# Altium schematic sheet 12_LMS2_Power.SchDoc: LMS7002M power supply (LMS2)
size A3; Organization: Lime Microsystems; Address1: Surrey Tech Centre; Address2: Guildford GU2 7YG; Address3: Surrey; Address4: United Kingdom; Revision: v1.0; SheetNumber: 10; SheetTotal: 31
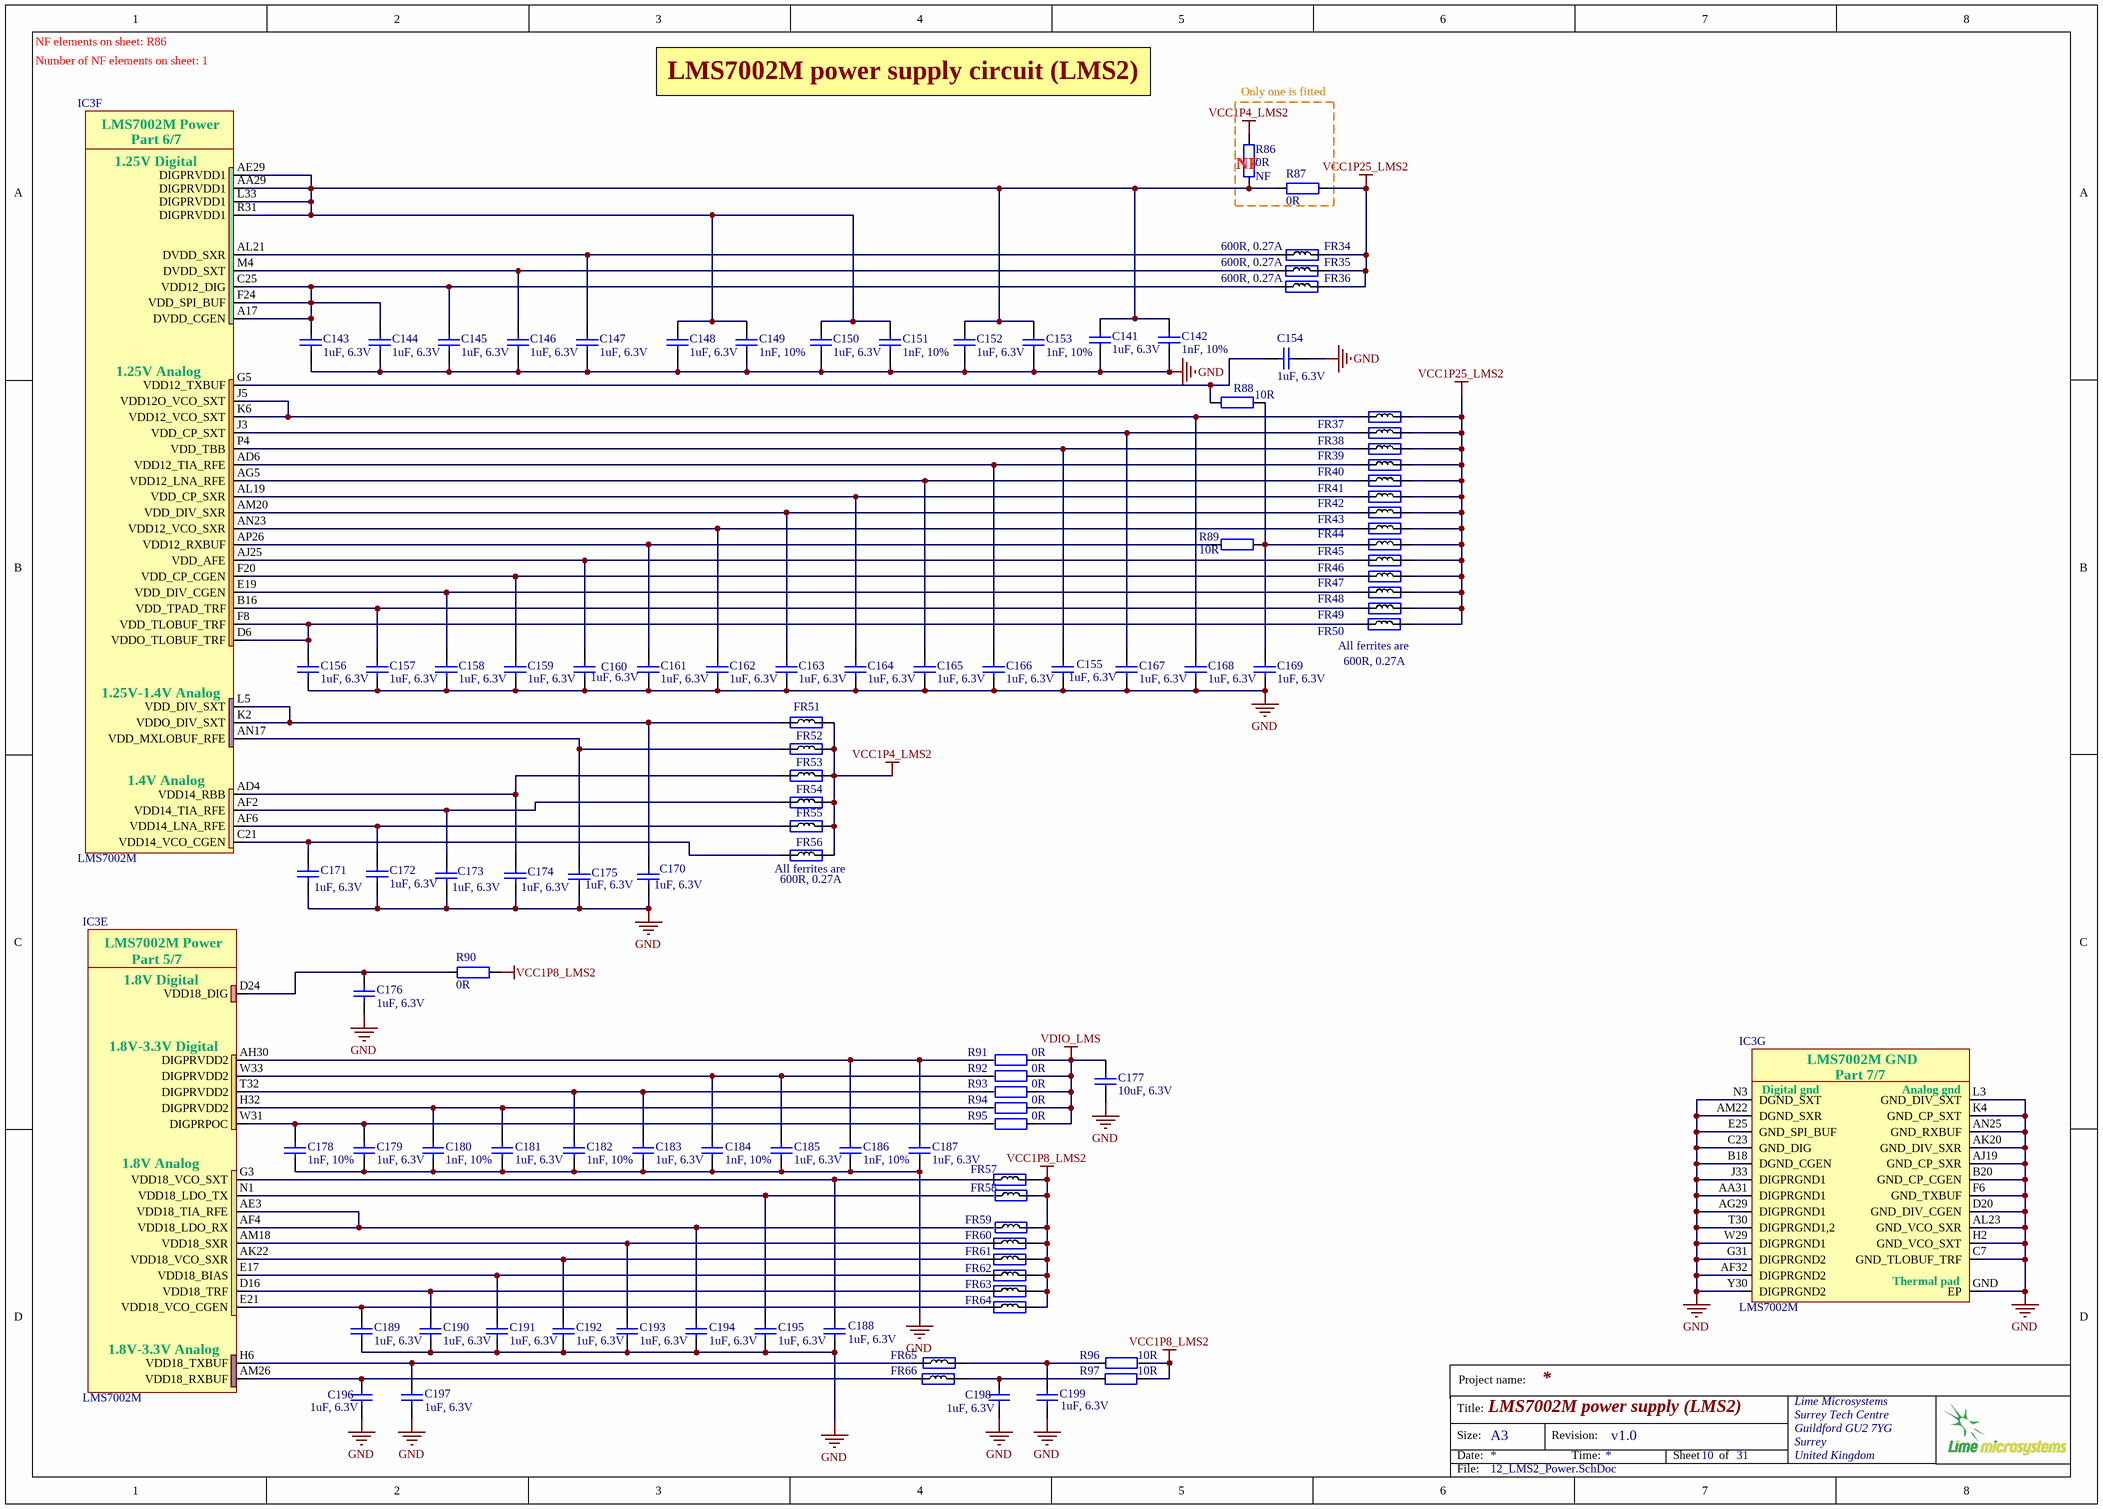
[diagram p0: 12_LMS2_Power.SchDoc]

## Parts
C141  1uF, 6.3V  [CAP0201]
C142  1nF, 10%  [CAP0201]
C143  1uF, 6.3V  [CAP0201]
C144  1uF, 6.3V  [CAP0201]
C145  1uF, 6.3V  [CAP0201]
C146  1uF, 6.3V  [CAP0201]
C147  1uF, 6.3V  [CAP0201]
C148  1uF, 6.3V  [CAP0201]
C149  1nF, 10%  [CAP0201]
C150  1uF, 6.3V  [CAP0201]
C151  1nF, 10%  [CAP0201]
C152  1uF, 6.3V  [CAP0201]
C153  1nF, 10%  [CAP0201]
C154  1uF, 6.3V  [CAP0201]
C155  1uF, 6.3V  [CAP0201]
C156  1uF, 6.3V  [CAP0201]
C157  1uF, 6.3V  [CAP0201]
C158  1uF, 6.3V  [CAP0201]
C159  1uF, 6.3V  [CAP0201]
C160  1uF, 6.3V  [CAP0201]
C161  1uF, 6.3V  [CAP0201]
C162  1uF, 6.3V  [CAP0201]
C163  1uF, 6.3V  [CAP0201]
C164  1uF, 6.3V  [CAP0201]
C165  1uF, 6.3V  [CAP0201]
C166  1uF, 6.3V  [CAP0201]
C167  1uF, 6.3V  [CAP0201]
C168  1uF, 6.3V  [CAP0201]
C169  1uF, 6.3V  [CAP0201]
C170  1uF, 6.3V  [CAP0201]
C171  1uF, 6.3V  [CAP0201]
C172  1uF, 6.3V  [CAP0201]
C173  1uF, 6.3V  [CAP0201]
C174  1uF, 6.3V  [CAP0201]
C175  1uF, 6.3V  [CAP0201]
C176  1uF, 6.3V  [CAP0201]
C177  10uF, 6.3V  [CAP0603]
C178  1nF, 10%  [CAP0201]
C179  1uF, 6.3V  [CAP0201]
C180  1nF, 10%  [CAP0201]
C181  1uF, 6.3V  [CAP0201]
C182  1nF, 10%  [CAP0201]
C183  1uF, 6.3V  [CAP0201]
C184  1nF, 10%  [CAP0201]
C185  1uF, 6.3V  [CAP0201]
C186  1nF, 10%  [CAP0201]
C187  1uF, 6.3V  [CAP0201]
C188  1uF, 6.3V  [CAP0201]
C189  1uF, 6.3V  [CAP0201]
C190  1uF, 6.3V  [CAP0201]
C191  1uF, 6.3V  [CAP0201]
C192  1uF, 6.3V  [CAP0201]
C193  1uF, 6.3V  [CAP0201]
C194  1uF, 6.3V  [CAP0201]
C195  1uF, 6.3V  [CAP0201]
C196  1uF, 6.3V  [CAP0201]
C197  1uF, 6.3V  [CAP0201]
C198  1uF, 6.3V  [CAP0201]
C199  1uF, 6.3V  [CAP0201]
FR34  600R, 0.27A  [RES0201]
FR35  600R, 0.27A  [RES0201]
FR36  600R, 0.27A  [RES0201]
FR37  600R, 0.27A  [RES0201]  (value not drawn)
FR38  600R, 0.27A  [RES0201]  (value not drawn)
FR39  600R, 0.27A  [RES0201]  (value not drawn)
FR40  600R, 0.27A  [RES0201]  (value not drawn)
FR41  600R, 0.27A  [RES0201]  (value not drawn)
FR42  600R, 0.27A  [RES0201]  (value not drawn)
FR43  600R, 0.27A  [RES0201]  (value not drawn)
FR44  600R, 0.27A  [RES0201]  (value not drawn)
FR45  600R, 0.27A  [RES0201]  (value not drawn)
FR46  600R, 0.27A  [RES0201]  (value not drawn)
FR47  600R, 0.27A  [RES0201]  (value not drawn)
FR48  600R, 0.27A  [RES0201]  (value not drawn)
FR49  600R, 0.27A  [RES0201]  (value not drawn)
FR50  600R, 0.27A  [RES0201]  (value not drawn)
FR51  600R, 0.27A  [RES0201]  (value not drawn)
FR52  600R, 0.27A  [RES0201]  (value not drawn)
FR53  600R, 0.27A  [RES0201]  (value not drawn)
FR54  600R, 0.27A  [RES0201]  (value not drawn)
FR55  600R, 0.27A  [RES0201]  (value not drawn)
FR56  600R, 0.27A  [RES0201]  (value not drawn)
FR57  600R, 0.27A  [RES0201]  (value not drawn)
FR58  600R, 0.27A  [RES0201]  (value not drawn)
FR59  600R, 0.27A  [RES0201]  (value not drawn)
FR60  600R, 0.27A  [RES0201]  (value not drawn)
FR61  600R, 0.27A  [RES0201]  (value not drawn)
FR62  600R, 0.27A  [RES0201]  (value not drawn)
FR63  600R, 0.27A  [RES0201]  (value not drawn)
FR64  600R, 0.27A  [RES0201]  (value not drawn)
FR65  600R, 0.27A  [RES0201]  (value not drawn)
FR66  600R, 0.27A  [RES0201]  (value not drawn)
IC3  LMS7002M  [LMS7002M_v5]  (parts E,F,G of 7)
R86  0R  Assembly Info: NF  [RES0402]
R87  0R  [RES0402]
R88  10R  [RES0201]
R89  10R  [RES0201]
R90  0R  [RES0201]
R91  0R  [RES0402]
R92  0R  [RES0402]
R93  0R  [RES0402]
R94  0R  [RES0402]
R95  0R  [RES0402]
R96  10R  [RES0201]
R97  10R  [RES0201]

## Blocks framed on the sheet
Only one is fitted: R86 R87

## Nets
GND: C141.2 C142.2 C143.2 C144.2 C145.2 C146.1 C147.2 C148.2 C149.2 C150.2 C151.2 C152.2 C153.2 C154.2 C155.2 C156.2 C157.2 C158.2 C159.1 C160.2 C161.2 C162.2 C163.2 C164.2 C165.2 C166.1 C167.2 C168.1 C169.1 C170.2 C171.2 C172.2 C173.2 C174.2 C175.2 C176.2 C177.1 C178.2 C179.2 C180.2 C181.2 C182.2 C183.2 C184.2 C185.2 C186.2 C187.2 C188.2 C189.2 C190.2 C191.2 C192.2 C193.2 C194.2 C195.2 C196.2 C197.2 C198.2 C199.2 IC3.AA31(DIGPRGND1) IC3.AF32(DIGPRGND2) IC3.AG29(DIGPRGND1) IC3.AJ19(GND_CP_SXR) IC3.AK20(GND_DIV_SXR) IC3.AL23(GND_VCO_SXR) IC3.AM22(DGND_SXR) IC3.AN25(GND_RXBUF) IC3.B18(DGND_CGEN) IC3.B20(GND_CP_CGEN) IC3.C7(GND_TLOBUF_TRF) IC3.C23(GND_DIG) IC3.D20(GND_DIV_CGEN) IC3.E25(GND_SPI_BUF) IC3.F6(GND_TXBUF) IC3.G31(DIGPRGND2) IC3.GND(EP) IC3.H2(GND_VCO_SXT) IC3.J33(DIGPRGND1) IC3.K4(GND_CP_SXT) IC3.L3(GND_DIV_SXT) IC3.N3(DGND_SXT) IC3.T30(DIGPRGND1,2) IC3.W29(DIGPRGND1) IC3.Y30(DIGPRGND2)
VCC1P4_LMS2: FR51.2 FR52.2 FR53.2 FR54.2 FR55.2 FR56.2 R86.1
VCC1P8_LMS2: FR57.2 FR58.1 FR59.1 FR60.2 FR61.2 FR62.2 FR63.2 FR64.2 R90.2 R96.2 R97.1
VCC1P25_LMS2: FR34.2 FR35.2 FR36.2 FR37.2 FR38.2 FR39.2 FR40.2 FR41.2 FR42.2 FR43.2 FR44.2 FR45.2 FR46.2 FR47.2 FR48.2 FR49.2 FR50.2 R87.1
VDIO_LMS: C177.2 R91.1 R92.1 R93.1 R94.1 R95.1
NetC141_1: C141.1 C142.1 C148.1 C149.1 C150.1 C151.1 C152.1 C153.1 IC3.AA29(DIGPRVDD1) IC3.AE29(DIGPRVDD1) IC3.L33(DIGPRVDD1) IC3.R31(DIGPRVDD1) R86.2 R87.2
NetC143_1: C143.1 C144.1 C145.1 FR36.1 IC3.A17(DVDD_CGEN) IC3.C25(VDD12_DIG) IC3.F24(VDD_SPI_BUF)
NetC146_2: C146.2 FR35.1 IC3.M4(DVDD_SXT)
NetC147_1: C147.1 FR34.1 IC3.AL21(DVDD_SXR)
NetC154_1: C154.1 IC3.G5(VDD12_TXBUF) R88.1
NetC155_1: C155.1 FR39.1 IC3.P4(VDD_TBB)
NetC156_1: C156.1 FR50.1 IC3.D6(VDDO_TLOBUF_TRF) IC3.F8(VDD_TLOBUF_TRF)
NetC157_1: C157.1 FR49.1 IC3.B16(VDD_TPAD_TRF)
NetC158_1: C158.1 FR48.1 IC3.E19(VDD_DIV_CGEN)
NetC159_2: C159.2 FR47.1 IC3.F20(VDD_CP_CGEN)
NetC160_1: C160.1 FR46.1 IC3.AJ25(VDD_AFE)
NetC161_1: C161.1 IC3.AP26(VDD12_RXBUF) R89.1
NetC162_1: C162.1 FR44.1 IC3.AN23(VDD12_VCO_SXR)
NetC163_1: C163.1 FR43.1 IC3.AM20(VDD_DIV_SXR)
NetC164_1: C164.1 FR42.1 IC3.AL19(VDD_CP_SXR)
NetC165_1: C165.1 FR41.1 IC3.AG5(VDD12_LNA_RFE)
NetC166_2: C166.2 FR40.1 IC3.AD6(VDD12_TIA_RFE)
NetC167_1: C167.1 FR38.1 IC3.J3(VDD_CP_SXT)
NetC168_2: C168.2 FR37.1 IC3.J5(VDD12O_VCO_SXT) IC3.K6(VDD12_VCO_SXT)
NetC169_2: C169.2 FR45.1 R88.2 R89.2
NetC170_1: C170.1 FR51.1 IC3.K2(VDDO_DIV_SXT) IC3.L5(VDD_DIV_SXT)
NetC171_1: C171.1 FR56.1 IC3.C21(VDD14_VCO_CGEN)
NetC172_1: C172.1 FR55.1 IC3.AF6(VDD14_LNA_RFE)
NetC173_1: C173.1 FR54.1 IC3.AF2(VDD14_TIA_RFE)
NetC174_1: C174.1 FR53.1 IC3.AD4(VDD14_RBB)
NetC175_1: C175.1 FR52.1 IC3.AN17(VDD_MXLOBUF_RFE)
NetC176_1: C176.1 IC3.D24(VDD18_DIG) R90.1
NetC178_1: C178.1 C179.1 IC3.W31(DIGPRPOC) R95.2
NetC180_1: C180.1 C181.1 IC3.H32(DIGPRVDD2) R94.2
NetC182_1: C182.1 C183.1 IC3.T32(DIGPRVDD2) R93.2
NetC184_1: C184.1 C185.1 IC3.W33(DIGPRVDD2) R92.2
NetC186_1: C186.1 C187.1 IC3.AH30(DIGPRVDD2) R91.2
NetC188_1: C188.1 FR57.1 IC3.G3(VDD18_VCO_SXT)
NetC189_1: C189.1 FR64.1 IC3.E21(VDD18_VCO_CGEN)
NetC190_1: C190.1 FR63.1 IC3.D16(VDD18_TRF)
NetC191_1: C191.1 FR62.1 IC3.E17(VDD18_BIAS)
NetC192_1: C192.1 FR61.1 IC3.AK22(VDD18_VCO_SXR)
NetC193_1: C193.1 FR60.1 IC3.AM18(VDD18_SXR)
NetC194_1: C194.1 FR59.2 IC3.AE3(VDD18_TIA_RFE) IC3.AF4(VDD18_LDO_RX)
NetC195_1: C195.1 FR58.2 IC3.N1(VDD18_LDO_TX)
NetC196_1: C196.1 FR66.1 IC3.AM26(VDD18_RXBUF)
NetC197_1: C197.1 FR65.2 IC3.H6(VDD18_TXBUF)
NetC198_1: C198.1 FR66.2 R97.2
NetC199_1: C199.1 FR65.1 R96.1

## Notes on the sheet
- NF elements on sheet: R86
- Number of NF elements on sheet: 1
- LMS7002M power supply circuit (LMS2)
- (near R86) NF
- (near FR50) All ferrites are
- 600R, 0.27A
- (near FR56) All ferrites are
- (near FR56) 600R, 0.27A
- Project name:
- Title:
- Size:
- Date:
- A3
- Revision:
- Time:
- Sheet
- of
- File:
- (in symbol LMS7002Mr4, part E) LMS7002M Power; Part 5/7; 1.8V Digital; 1.8V-3.3V Digital; 1.8V Analog; 1.8V-3.3V Analog
- (in symbol LMS7002Mr4, part F) LMS7002M Power; Part 6/7; 1.25V Digital; 1.25V Analog; 1.25V-1.4V Analog; 1.4V Analog
- (in symbol LMS7002Mr4, part G) LMS7002M GND; Part 7/7; Digital gnd; Analog gnd; Thermal pad

## Library data of the parts
C141 C143-C148 C150 C152 C154-C176 C179 C181 C183 C185 C187-C199 = Cap_0402: Manufacturer: TDK Corporation; Manufacturer Part Number 1: JMK063ABJ105MP-F; Part Description: 1µF ±20% 6.3V X5R Ceramic Capacitor -55°C ~ 85°C Surface Mount, MLCC 0201 (0603 Metric) 0.024" L x 0.012" W (0.60mm x 0.30mm); Value: 1uF, 20%; Tolerance: ±20%; Capacitance: 1.0µF; Temperature Coefficient: X5R; Supplier 1: Digi-Key; Supplier Part Number 1: 587-5864-2-ND; Applications: General Purpose; Features: -; Lead Style: -; Ratings: -; Thickness (Max): -; Lead Spacing: -; Height - Seated (Max): -; Size / Dimension: 0.024" L x 0.012" W (0.60mm x 0.30mm); Mounting Type: Surface Mount, MLCC; Operating Temperature: -55°C ~ 85°C; Package / Case: 0201 (0603 Metric); Packaging: Cut Tape (CT); Voltage - Rated: 6.3V; Category: Capacitors; RoHS: RoHS Compliant
C142 C149 C151 C153 C178 C180 C182 C184 C186 = Cap_0402: Manufacturer Part Number 1: C0603X7R1E102K030BA; Manufacturer: TDK Corporation; Part Description: 1000pF ±10% 25V X7R Ceramic Capacitor -55°C ~ 125°C Surface Mount, MLCC 0201 (0603 Metric) 0.024" L x 0.012" W (0.60mm x 0.30mm); Voltage - Rated: 25V; Temperature Coefficient: X7R; Capacitance: 1000pF; Value: 1nF, 10%; Supplier 1: Digi-Key; Supplier Part Number 1: 445-7275-1-ND; Features: -; Package / Case: 0201 (0603 Metric); Lead Spacing: -; Mounting Type: Surface Mount, MLCC; Lead Style: -; Height - Seated (Max): -; Operating Temperature: -55°C ~ 125°C; Tolerance: ±10%; Size / Dimension: 0.024" L x 0.012" W (0.60mm x 0.30mm); Applications: General Purpose; Ratings: -; Thickness (Max): 0.013" (0.33mm); RoHS: RoHS Compliant; Packaging: Cut Tape (CT); Category: Capacitors
C177 = Cap_0603: Manufacturer Part Number 1: CC0603MRX5R5BB106; Manufacturer: Yageo; Part Description: 10µF ±20% 6.3V X5R Ceramic Capacitor -55°C ~ 85°C Surface Mount, MLCC 0603 (1608 Metric) 0.063" L x 0.031" W (1.60mm x 0.80mm); Capacitance: 10µF; Tolerance: ±20%; Supplier 1: Digi-Key; Supplier Part Number 1: 311-1448-2-ND; Package / Case: 0603 (1608 Metric); Category: Capacitors; Voltage - Rated: 6.3V; Value: 10uF, 6.3V
FR34-FR66 = Ferrite: Manufacturer Part Number 1: BK0603TS601-T; Manufacturer: Taiyo Yuden; Part Description: FERRITE BEAD 600 OHM 0201 1LN; DC Resistance (DCR): 750 mOhm Max; Filter Type: Differential Mode - Single; Impedance @ Frequency: 600 Ohm @ 100MHz; Current Rating: 270mA; Value: 600R@100MHz; Supplier 1: Digi-Key; Supplier Part Number 1: 587-3277-1-ND; Size / Dimension: 0.024" L x 0.012" W (0.60mm x 0.30mm); Package / Case: 0201 (0603 Metric); Height (Max): 0.013" (0.33mm); Mounting Type: Surface Mount; Packaging: Cut Tape (CT); RoHS: RoHS Compliant; Category: Filters
IC3 = LMS7002Mr4: Schematic symbol revision 4. Default footprint - 0.31mm pad; Manufacturer: Lime Microsystems; Part Description: IC FPRF Transceiver LMS7002M; 261 pin aQFN; Supplier 1: Lime Microsystems; Supplier Part Number 1: LMS7002M; Manufacturer Part Number 1: LMS7002M
R86 R87 R91-R95 = Res_0402: Manufacturer Part Number 1: RC0402JR-070RL; Manufacturer: Yageo; Part Description: RES SMD 0.0OHM JUMPER 1/16W 0402; Resistance (Ohms): 0.0; Tolerance: Jumper; Power (Watts): 0.063W, 1/16W; Value: 0R; Supplier 1: Digi-Key; Supplier Part Number 1: 311-0.0JRTR-ND; Category: Resistors; Temperature Coefficient: -; Features: Moisture Resistant; Supplier Device Package: 0402; Height: 0.016" (0.40mm); Package / Case: 0402 (1005 Metric); Operating Temperature: -55°C ~ 155°C; Size / Dimension: 0.039" L x 0.020" W (1.00mm x 0.50mm); Composition: Thick Film; Packaging: Tape & Reel (TR); Number of Terminations: 2; RoHS: RoHS Compliant
R88 R89 R96 R97 = Res_0402: Manufacturer: Panasonic Electronic Components; Part Description: RES SMD 10 OHM 1% 1/20W 0201; Manufacturer Part Number 1: ERJ-1GEF10R0C; Power (Watts): 0.05W, 1/20W; Resistance (Ohms): 10; Tolerance: ±1%; Temperature Coefficient: ±200ppm/°C; Value: 10R; Supplier 1: Digi-Key; Supplier Part Number 1: P10.0ABCT-ND; Package / Case: 0201 (0603 Metric); Height: 0.010" (0.26mm); Supplier Device Package: 0201; Packaging: Cut Tape (CT); Composition: Thick Film; Category: Resistors; Number of Terminations: 2; Size / Dimension: 0.024" L x 0.012" W (0.60mm x 0.30mm); Operating Temperature: -55°C ~ 125°C; Features: -; RoHS: RoHS Compliant
R90 = Res_0402: Manufacturer Part Number 1: RC0201FR-070RL; Manufacturer: Rohm Semiconductor; Part Description: RES SMD 0.0OHM JUMPER 1/20W 0201; Resistance (Ohms): 0.0; Power (Watts): 0.05W, 1/20W; Tolerance: Jumper; Value: 0R; Supplier 1: Digi-Key; Supplier Part Number 1: 311-0.0MCT-ND; Number of Terminations: 2; Operating Temperature: -55°C ~ 125°C; Package / Case: 0201 (0603 Metric); Height: 0.010" (0.26mm); Supplier Device Package: 0201 (0603 Metric); Size / Dimension: 0.024" L x 0.012" W (0.60mm x 0.30mm); Temperature Coefficient: -; Category: Resistors; Features: -; RoHS: RoHS Compliant; Composition: Thick Film; Packaging: Cut Tape (CT)